# EAGLE design ada2 (EAGLE 6.5.0)
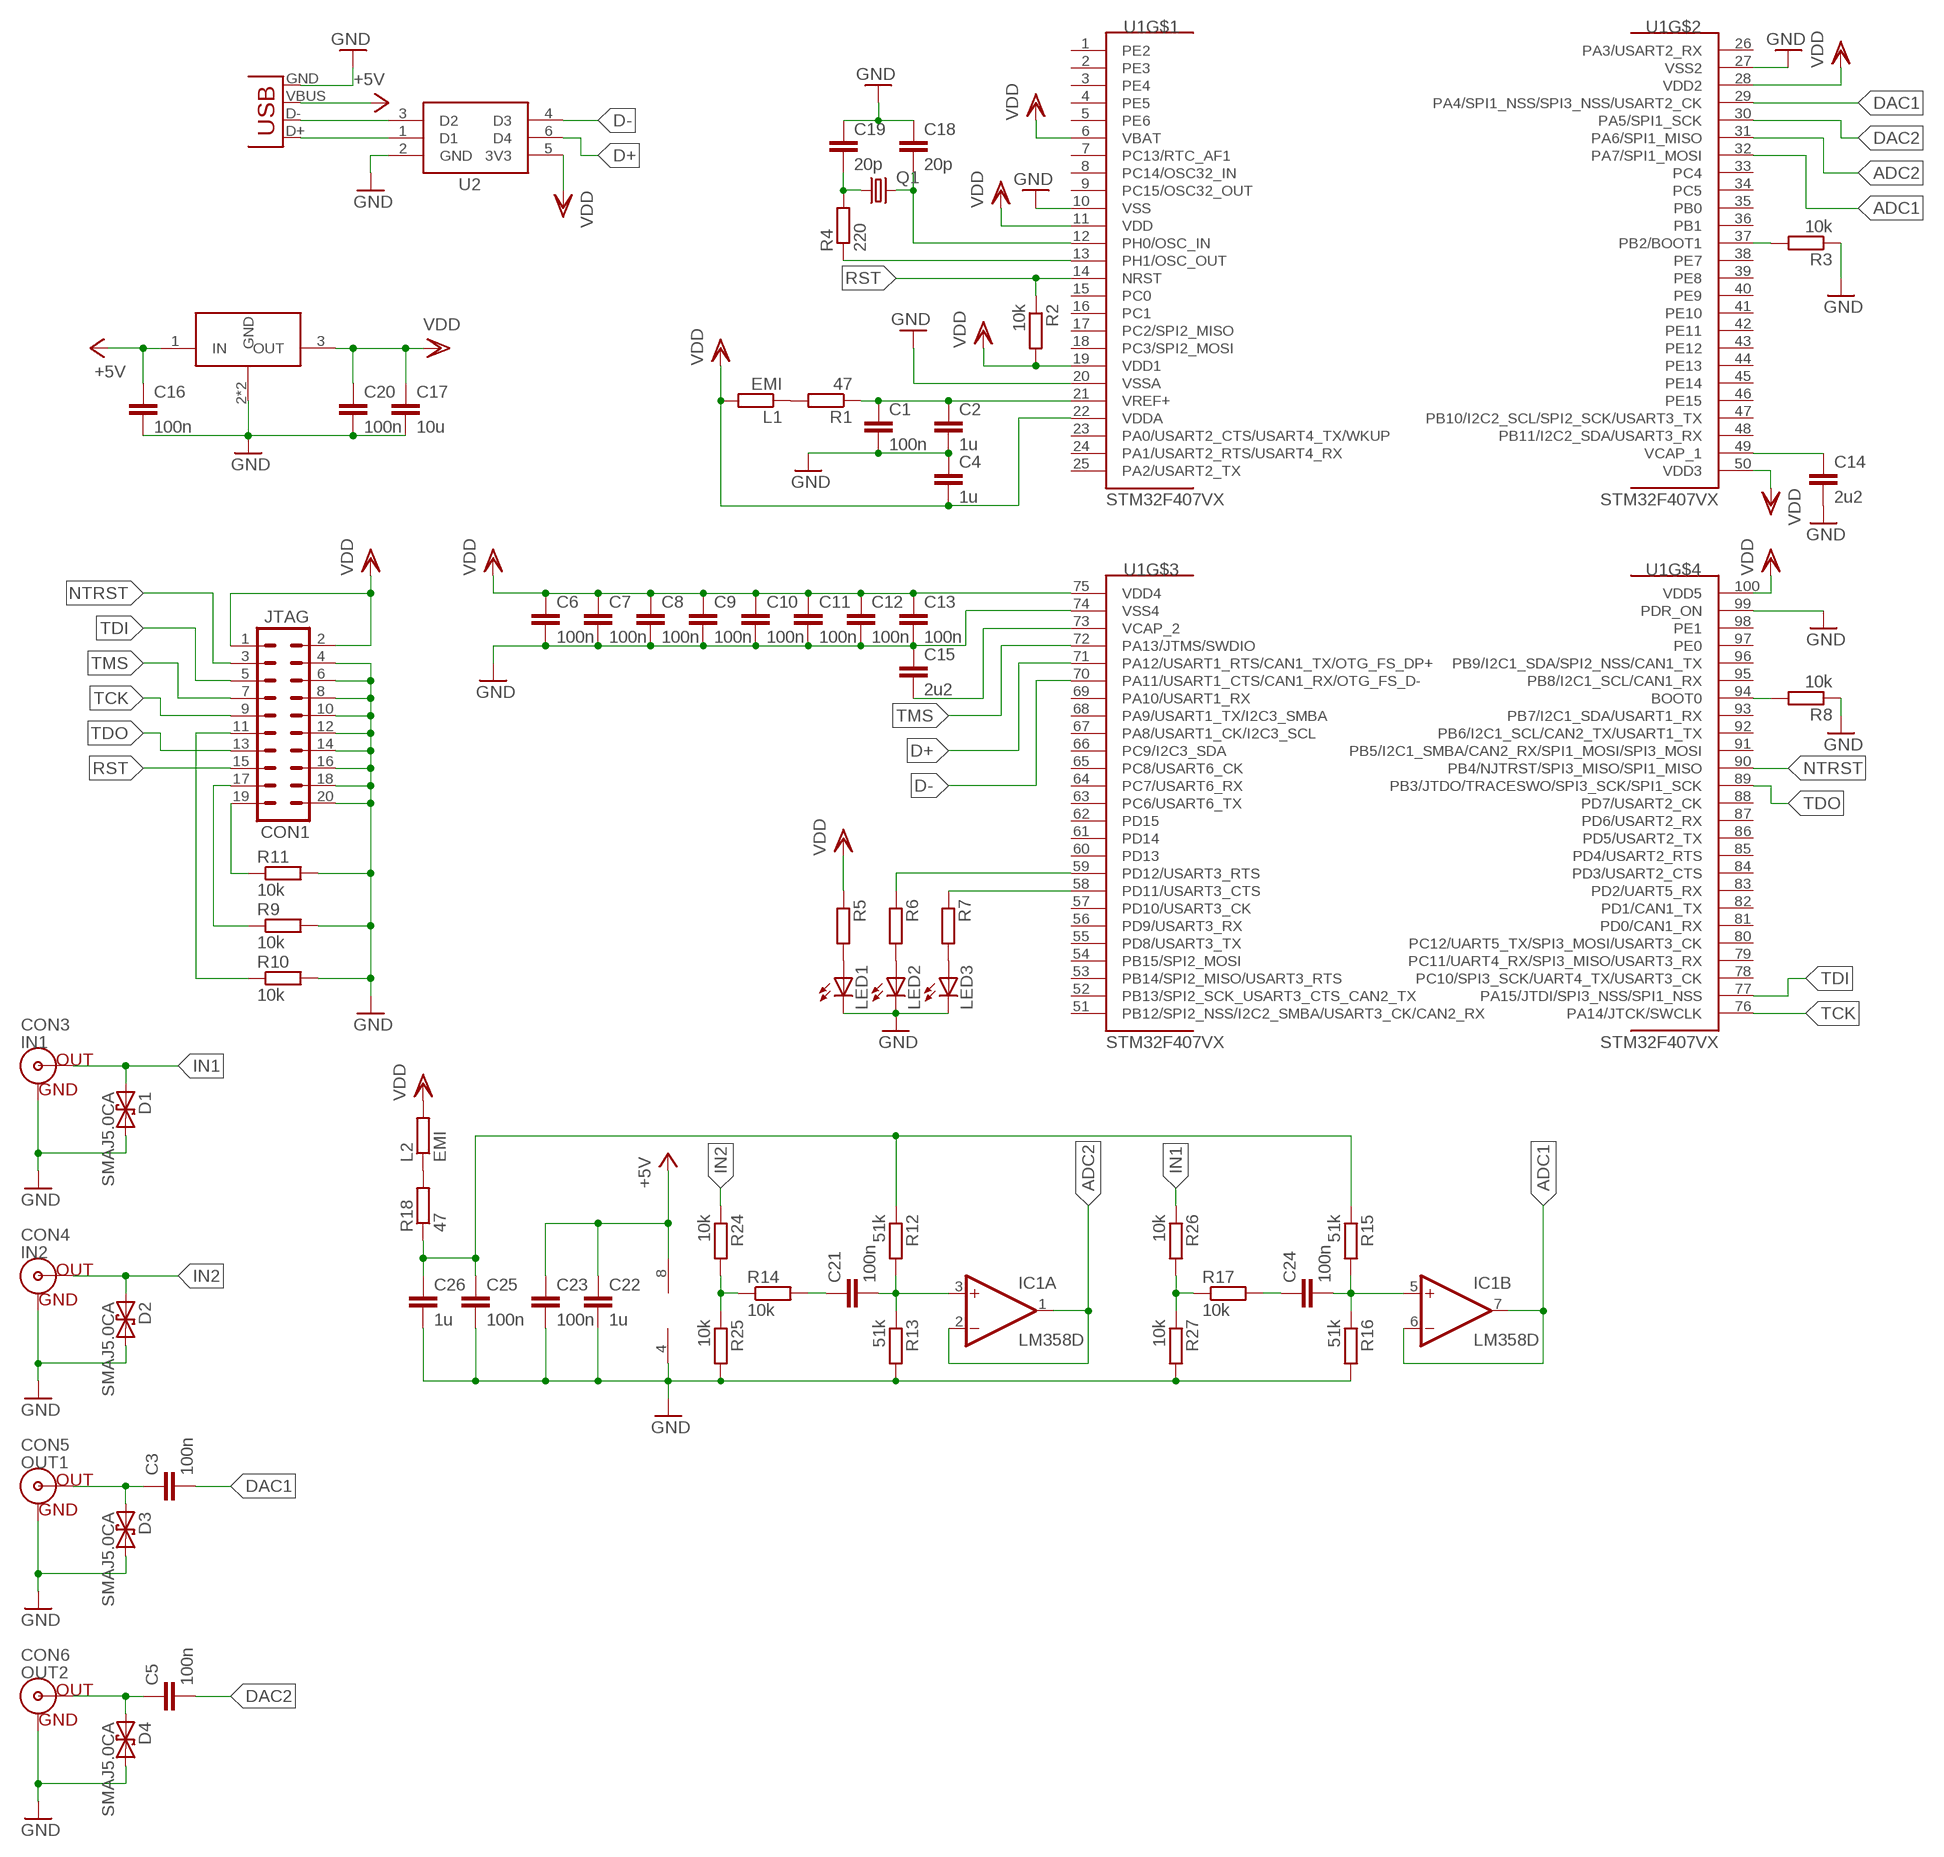
[diagram p0: schematic, sheet 1]

## Parts
C1  100n  C-EUC0603K  [C0603K]
C2  1u  C-EUC0603K  [C0603K]
C3  100n  C-EUC0603K  [C0603K]
C4  1u  C-EUC0603K  [C0603K]
C5  100n  C-EUC0603K  [C0603K]
C6  100n  C-EUC0603K  [C0603K]
C7  100n  C-EUC0603K  [C0603K]
C8  100n  C-EUC0603K  [C0603K]
C9  100n  C-EUC0603K  [C0603K]
C10  100n  C-EUC0603K  [C0603K]
C11  100n  C-EUC0603K  [C0603K]
C12  100n  C-EUC0603K  [C0603K]
C13  100n  C-EUC0603K  [C0603K]
C14  2u2  C-EUC0603K  [C0603K]
C15  2u2  C-EUC0603K  [C0603K]
C16  100n  C-EUC0603K  [C0603K]
C17  10u  C-EUC0603K  [C0603K]
C18  20p  C-EUC0603K  [C0603K]
C19  20p  C-EUC0603K  [C0603K]
C20  100n  C-EUC0603K  [C0603K]
C21  100n  C-EUC0603K  [C0603K]
C22  1u  C-EUC0603K  [C0603K]
C23  100n  C-EUC0603K  [C0603K]
C24  100n  C-EUC0603K  [C0603K]
C25  100n  C-EUC0603K  [C0603K]
C26  1u  C-EUC0603K  [C0603K]
CON1  JTAG  ML20  [ML20]
CON2  USB-B  USBPTH  [USB-B-PTH]
CON3  IN1  BNCPTH  [BNC]
CON4  IN2  BNCPTH  [BNC]
CON5  OUT1  BNCPTH  [BNC]
CON6  OUT2  BNCPTH  [BNC]
D1  SMAJ5.0CA  TVS  [SMA-DIODE]
D2  SMAJ5.0CA  TVS  [SMA-DIODE]
D3  SMAJ5.0CA  TVS  [SMA-DIODE]
D4  SMAJ5.0CA  TVS  [SMA-DIODE]
IC1  LM358D  [SO08]
L1  EMI  R-EU_R0603  [R0603]
L2  EMI  R-EU_R0603  [R0603]
LED1  KONTROLKA_LED  [KONTROLKA_LED]
LED2  KONTROLKA_LED  [KONTROLKA_LED]
LED3  KONTROLKA_LED  [KONTROLKA_LED]
Q1  CRYSTALHC49UP  [HC49UP]
R1  47  R-EU_R0603  [R0603]
R2  10k  R-EU_R0603  [R0603]
R3  10k  R-EU_R0603  [R0603]
R4  220  R-EU_R0603  [R0603]
R5  R-EU_R0603  [R0603]
R6  R-EU_R0603  [R0603]
R7  R-EU_R0603  [R0603]
R8  10k  R-EU_R0603  [R0603]
R9  10k  R-EU_R0603  [R0603]
R10  10k  R-EU_R0603  [R0603]
R11  10k  R-EU_R0603  [R0603]
R12  51k  R-EU_R0603  [R0603]
R13  51k  R-EU_R0603  [R0603]
R14  10k  R-EU_R0603  [R0603]
R15  51k  R-EU_R0603  [R0603]
R16  51k  R-EU_R0603  [R0603]
R17  10k  R-EU_R0603  [R0603]
R18  47  R-EU_R0603  [R0603]
R24  10k  R-EU_R0603  [R0603]
R25  10k  R-EU_R0603  [R0603]
R26  10k  R-EU_R0603  [R0603]
R27  10k  R-EU_R0603  [R0603]
U1  STM32F407VX  [LQFP100]
U2  USBUF01W6  [SOT363]
U3  MCP1703  [SOT223]

## Nets
+5V: C16.1 C22.1 C23.1 CON2.VBUS IC1.8(P:V+) U3.1(IN)
ADC1: IC1.6(B:-IN) IC1.7(B:OUT) U1.32(PA7/SPI1_MOSI)
ADC2: IC1.1(A:OUT) IC1.2(A:-IN) U1.31(PA6/SPI1_MISO)
D+: U1.71(PA12/USART1_RTS/CAN1_TX/OTG_FS_DP+) U2.6(D4)
D-: U1.70(PA11/USART1_CTS/CAN1_RX/OTG_FS_D-) U2.4(D3)
DAC1: C3.2 U1.29(PA4/SPI1_NSS/SPI3_NSS/USART2_CK)
DAC2: C5.2 U1.30(PA5/SPI1_SCK)
GND: C1.2 C2.2 C4.1 C6.2 C7.2 C8.2 C9.2 C10.2 C11.2 C12.2 C13.2 C14.2 C15.1 C16.2 C17.2 C18.1 C19.1 C20.2 C22.2 C23.2 C25.2 C26.2 CON1.4 CON1.6 CON1.8 CON1.10 CON1.12 CON1.14 CON1.16 CON1.18 CON1.20 CON2.GND CON3.GND CON4.GND CON5.GND CON6.GND D1.C D2.C D3.C D4.C IC1.4(P:V-) LED1.K(C) LED2.K(C) LED3.K(C) R3.1 R8.1 R9.2 R10.2 R11.2 R13.2 R16.2 R25.2 R27.2 U1.10(VSS) U1.20(VSSA) U1.27(VSS2) U1.74(VSS4) U1.99(PDR_ON) U2.2(GND) U3.2(GND) U3.2@2(GND)
IN1: CON3.S(OUT) D1.A R26.1
IN2: CON4.S(OUT) D2.A R24.1
N$1: L1.1 R1.2
N$2: C21.1 R14.2
N$3: CON2.D- U2.3(D2)
N$4: CON2.D+ U2.1(D1)
N$5: R4.1 U1.13(PH1/OSC_OUT)
N$6: C19.2 Q1.1 R4.2
N$7: C15.2 U1.73(VCAP_2)
N$8: C14.1 U1.49(VCAP_1)
N$9: C3.1 CON5.S(OUT) D3.A
N$10: R3.2 U1.37(PB2/BOOT1)
N$11: C18.2 Q1.2 U1.12(PH0/OSC_IN)
N$12: LED1.A R5.2
N$13: LED2.A R6.2
N$14: LED3.A R7.2
N$15: R7.1 U1.58(PD11/USART3_CTS)
N$16: R6.1 U1.59(PD12/USART3_RTS)
N$17: C5.1 CON6.S(OUT) D4.A
N$18: CON1.19 R11.1
N$19: CON1.17 R9.1
N$20: CON1.11 R10.1
N$21: R14.1 R24.2 R25.1
N$22: L2.1 R18.2
N$23: C21.2 IC1.3(A:+IN) R12.2 R13.1
N$24: C24.1 R17.2
N$25: C25.1 C26.1 R12.1 R15.1 R18.1
N$26: R17.1 R26.2 R27.1
N$28: R8.2 U1.94(BOOT0)
N$31: C24.2 IC1.5(B:+IN) R15.2 R16.1
NTRST: CON1.3 U1.90(PB4/NJTRST/SPI3_MISO/SPI1_MISO)
RST: CON1.15 R2.1 U1.14(NRST)
TCK: CON1.9 U1.76(PA14/JTCK/SWCLK)
TDI: CON1.5 U1.77(PA15/JTDI/SPI3_NSS/SPI1_NSS)
TDO: CON1.13 U1.89(PB3/JTDO/TRACESWO/SPI3_SCK/SPI1_SCK)
TMS: CON1.7 U1.72(PA13/JTMS/SWDIO)
VDD: C4.2 C6.1 C7.1 C8.1 C9.1 C10.1 C11.1 C12.1 C13.1 C17.1 C20.1 CON1.1 CON1.2 L1.2 L2.2 R2.2 R5.1 U1.6(VBAT) U1.11(VDD) U1.19(VDD1) U1.22(VDDA) U1.28(VDD2) U1.50(VDD3) U1.75(VDD4) U1.100(VDD5) U2.5(3V3) U3.3(OUT)
VREF: C1.1 C2.1 R1.1 U1.21(VREF+)
Unconnected: U1.1(PE2) U1.2(PE3) U1.3(PE4) U1.4(PE5) U1.5(PE6) U1.7(PC13/RTC_AF1) U1.8(PC14/OSC32_IN) U1.9(PC15/OSC32_OUT) U1.15(PC0) U1.16(PC1) U1.17(PC2/SPI2_MISO) U1.18(PC3/SPI2_MOSI) U1.23(PA0/USART2_CTS/USART4_TX/WKUP) U1.24(PA1/USART2_RTS/USART4_RX) U1.25(PA2/USART2_TX) U1.26(PA3/USART2_RX) U1.33(PC4) U1.34(PC5) U1.35(PB0) U1.36(PB1) U1.38(PE7) U1.39(PE8) U1.40(PE9) U1.41(PE10) U1.42(PE11) U1.43(PE12) U1.44(PE13) U1.45(PE14) U1.46(PE15) U1.47(PB10/I2C2_SCL/SPI2_SCK/USART3_TX) U1.48(PB11/I2C2_SDA/USART3_RX) U1.51(PB12/SPI2_NSS/I2C2_SMBA/USART3_CK/CAN2_RX) U1.52(PB13/SPI2_SCK_USART3_CTS_CAN2_TX) U1.53(PB14/SPI2_MISO/USART3_RTS) U1.54(PB15/SPI2_MOSI) U1.55(PD8/USART3_TX) U1.56(PD9/USART3_RX) U1.57(PD10/USART3_CK) U1.60(PD13) U1.61(PD14) U1.62(PD15) U1.63(PC6/USART6_TX) U1.64(PC7/USART6_RX) U1.65(PC8/USART6_CK) U1.66(PC9/I2C3_SDA) U1.67(PA8/USART1_CK/I2C3_SCL) U1.68(PA9/USART1_TX/I2C3_SMBA) U1.69(PA10/USART1_RX) U1.78(PC10/SPI3_SCK/UART4_TX/USART3_CK) U1.79(PC11/UART4_RX/SPI3_MISO/USART3_RX) U1.80(PC12/UART5_TX/SPI3_MOSI/USART3_CK) U1.81(PD0/CAN1_RX) U1.82(PD1/CAN1_TX) U1.83(PD2/UART5_RX) U1.84(PD3/USART2_CTS) U1.85(PD4/USART2_RTS) U1.86(PD5/USART2_TX) U1.87(PD6/USART2_RX) U1.88(PD7/USART2_CK) U1.91(PB5/I2C1_SMBA/CAN2_RX/SPI1_MOSI/SPI3_MOSI) U1.92(PB6/I2C1_SCL/CAN2_TX/USART1_TX) U1.93(PB7/I2C1_SDA/USART1_RX) U1.95(PB8/I2C1_SCL/CAN1_RX) U1.96(PB9/I2C1_SDA/SPI2_NSS/CAN1_TX) U1.97(PE0) U1.98(PE1)

## Library data of the parts
C1-C26 = rcl:C-EU: CAPACITOR, European symbol
CON1 = con-ml:ML20: HARTING
CON2 = SparkFun-Connectors:USB: USB Connectors USB-B-PTH is fully proven SKU : PRT-00139/CONN-08278 USB-miniB is fully proven SKU : PRT-00587 USB-A-PCB is untested. USB-A-H is throughly reviewed, but untested. Spark Fun Electronics SKU : PRT-00437 USB-B-SMT is throughly reviewed, but untested. Needs silkscreen touching up. USB-A-S has not been used/tested USB-MB-H has not been used/tested USB-MICROB has been used. CONN-09505; PROD_ID: CONN-08278
CON3-CON6 = SparkFun:BNC: BNC Connector, Mouser Part# 5227161
D1-D4 = SparkFun:TVS
IC1 = linear:LM358: OP AMP also LM158; LM258; LM2904 Source: http://cache.national.com/ds/LM/LM158.pdf
L1 L2 R1-R18 R24-R27 = rcl:R-EU_: RESISTOR, European symbol
LED1-LED3 = Gibol2:KONTROLKA_LED
Q1 = crystal:CRYSTAL: CRYSTAL; OC_FARNELL: unknown; OC_NEWARK: unknown
U1 = STM32F407Vx_LQFP100:STM32F407VX: STmicroelectronics Cortex M4 Series Typ: STM32F407Vx LQFP100 Copyright 2012 by Ersan Günes, Quantitec, info@quantitec.de
U2 = Gibol2:USBUF01W6
U3 = Gibol:MCP1703

## Board
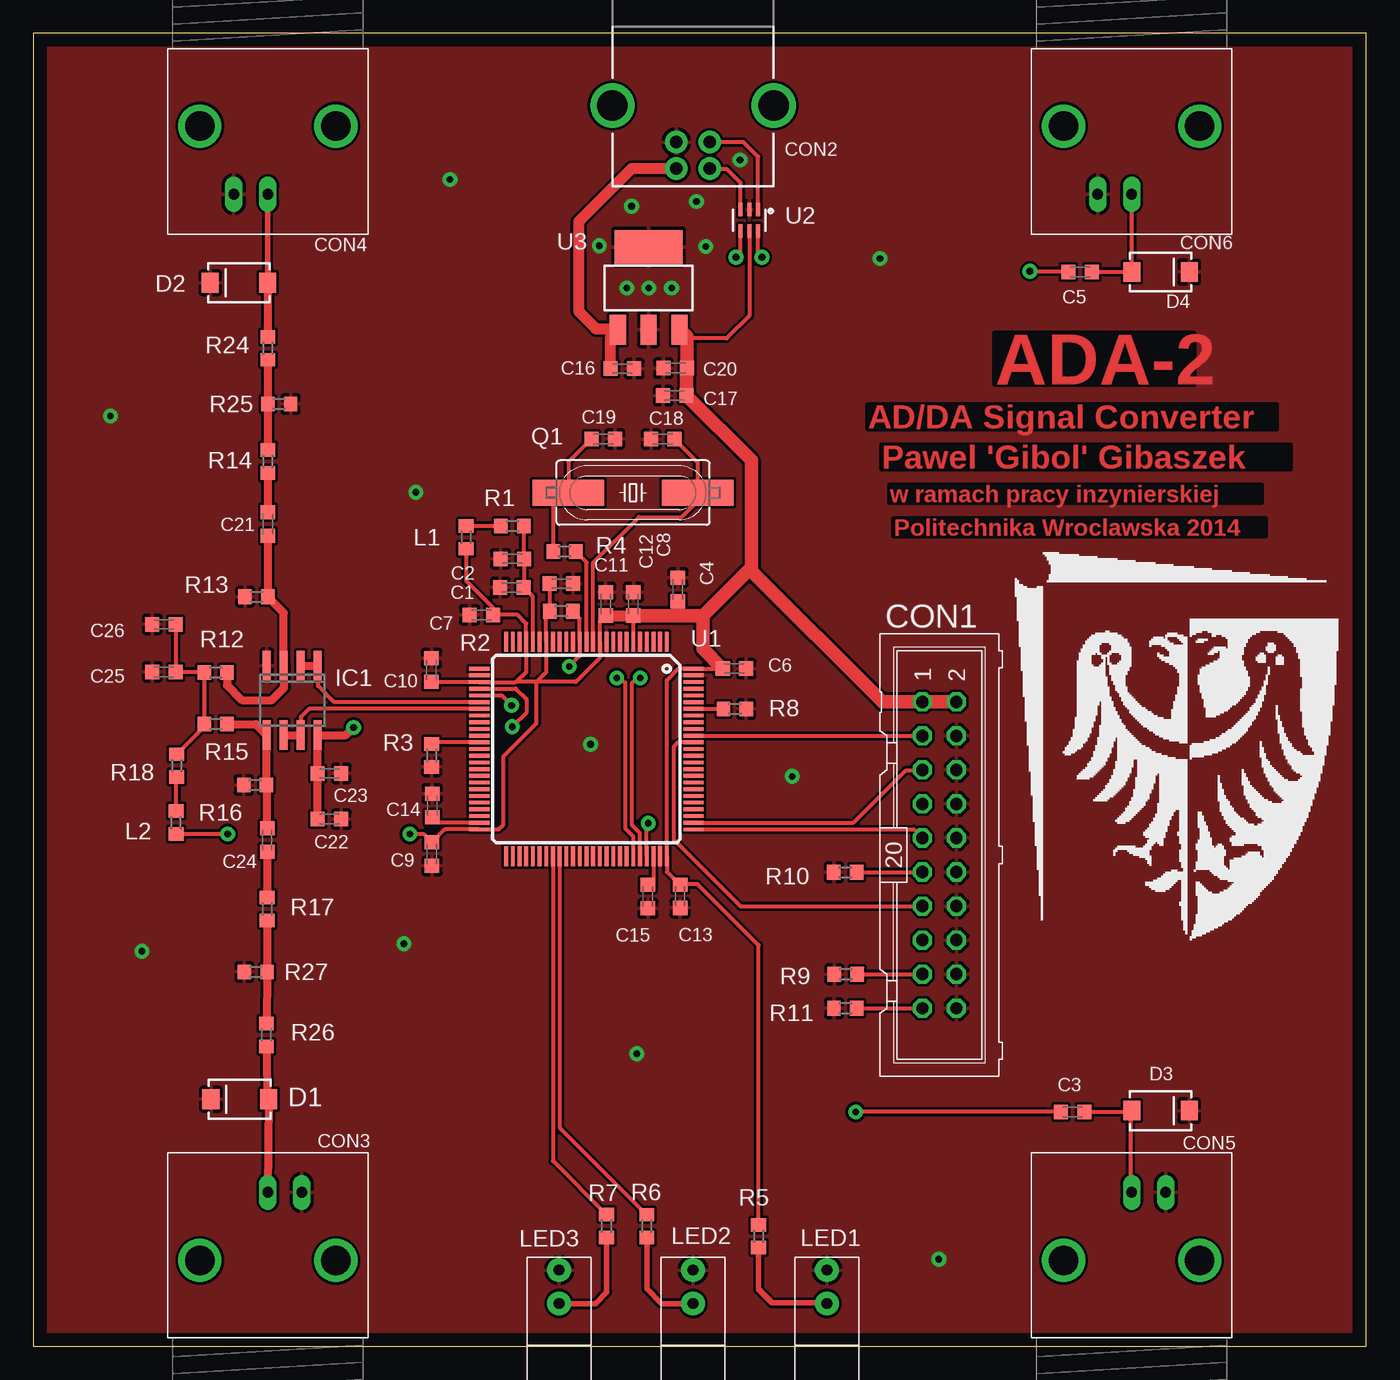
[diagram p1: board, top side]
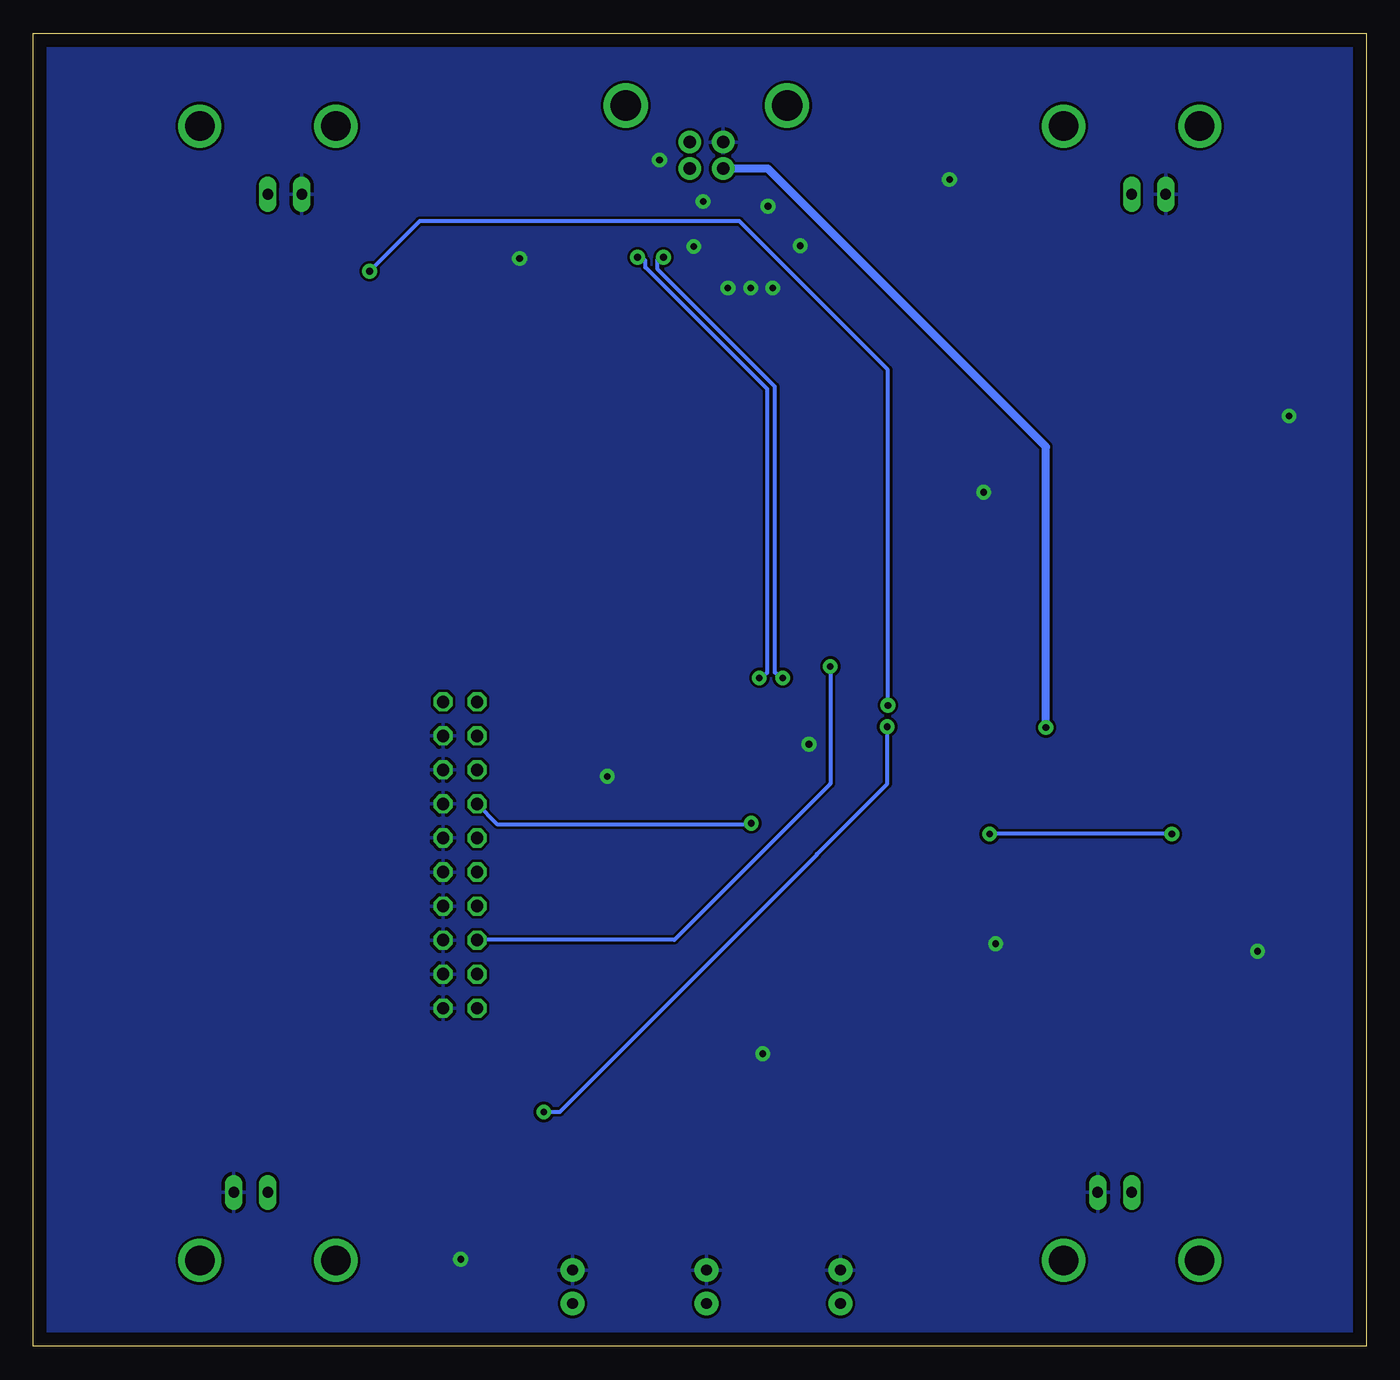
[diagram p2: board, bottom side, seen from below]

Size 99.5 x 98 mm. Coordinates in mm from the lower left corner, seen from the top.
Outline: 0,0 99.5,0 99.5,98 0,98 0,0
Copper layers (1*16): Top 0.035mm / dielectric 1.5mm / Bottom 0.035mm
Design rules "default *": minimum track width 8mil, minimum drill 0.5mm, track to track 8mil, track to pad 8mil, pad to pad 8mil, via to via 8mil, smd to smd 8mil, copper to edge 40mil, drill to drill 8mil, minimum pad ring 10mil, minimum via ring 8mil, stop-mask expansion 4mil, vias tented up to drill 0mil, thermal gap 10mil

### Footprints (pad centres in the part's own frame; a part is rotated, then mirrored left to right if it is on the bottom)
C0603K = smd 1.05 x 1.08: 1 -0.875,0; 2 0.875,0
ML20 = drill 0.914 octagon: 1 -11.43,-1.27; 2 -11.43,1.27; 3 -8.89,-1.27; 4 -8.89,1.27; 5 -6.35,-1.27; 6 -6.35,1.27; 7 -3.81,-1.27; 8 -3.81,1.27; 9 -1.27,-1.27; 10 -1.27,1.27; 11 1.27,-1.27; 12 1.27,1.27; 13 3.81,-1.27; 14 3.81,1.27; 15 6.35,-1.27; 16 6.35,1.27; 17 8.89,-1.27; 18 8.89,1.27; 19 11.43,-1.27; 20 11.43,1.27
USB-B-PTH = drill 0.914 pad 1.676: D+ 0,1.25; D- 1.981,1.25; GND 0,-1.25; VBUS 1.981,-1.25 | drill 2.286: S1 -2.718,-6.02; S2 -2.718,6.02
BNC = drill 2.2: 3 -5.08,5.08; 4 5.08,5.08 | drill 0.8 long: GND -2.54,0; S 0,0
SMA-DIODE = smd 1.27 x 1.47: A -2.15,0; C 2.15,0
SO08 = smd 0.6 x 2.2: 1 -1.905,-2.6; 2 -0.635,-2.6; 3 0.635,-2.6; 4 1.905,-2.6; 5 1.905,2.6; 6 0.635,2.6; 7 -0.635,2.6; 8 -1.905,2.6
R0603 = smd 1 x 1.1: 1 -0.85,0; 2 0.85,0
KONTROLKA_LED = drill 0.8 pad 1.778: A 0,-1.25; K 0,1.25
HC49UP = smd 5.334 x 1.93: 1 -4.826,0; 2 4.826,0
LQFP100 = smd 1.5 x 0.28: 1 -8,6; 2 -8,5.5; 3 -8,5; 4 -8,4.5; 5 -8,4; 6 -8,3.5; 7 -8,3; 8 -8,2.5; 9 -8,2; 10 -8,1.5; 11 -8,1; 12 -8,0.5; 13 -8,0; 14 -8,-0.5; 15 -8,-1; 16 -8,-1.5; 17 -8,-2; 18 -8,-2.5; 19 -8,-3; 20 -8,-3.5; 21 -8,-4; 22 -8,-4.5; 23 -8,-5; 24 -8,-5.5; 25 -8,-6; 51 8,-6; 52 8,-5.5; 53 8,-5; 54 8,-4.5; 55 8,-4; 56 8,-3.5; 57 8,-3; 58 8,-2.5; 59 8,-2; 60 8,-1.5; 61 8,-1; 62 8,-0.5; 63 8,0; 64 8,0.5; 65 8,1; 66 8,1.5; 67 8,2; 68 8,2.5; 69 8,3; 70 8,3.5; 71 8,4; 72 8,4.5; 73 8,5; 74 8,5.5; 75 8,6 | smd 0.28 x 1.5: 26 -6,-8; 27 -5.5,-8; 28 -5,-8; 29 -4.5,-8; 30 -4,-8; 31 -3.5,-8; 32 -3,-8; 33 -2.5,-8; 34 -2,-8; 35 -1.5,-8; 36 -1,-8; 37 -0.5,-8; 38 0,-8; 39 0.5,-8; 40 1,-8; 41 1.5,-8; 42 2,-8; 43 2.5,-8; 44 3,-8; 45 3.5,-8; 46 4,-8; 47 4.5,-8; 48 5,-8; 49 5.5,-8; 50 6,-8; 76 6,8; 77 5.5,8; 78 5,8; 79 4.5,8; 80 4,8; 81 3.5,8; 82 3,8; 83 2.5,8; 84 2,8; 85 1.5,8; 86 1,8; 87 0.5,8; 88 0,8; 89 -0.5,8; 90 -1,8; 91 -1.5,8; 92 -2,8; 93 -2.5,8; 94 -3,8; 95 -3.5,8; 96 -4,8; 97 -4.5,8; 98 -5,8; 99 -5.5,8; 100 -6,8
SOT363 = smd 0.3 x 0.99: 1 -0.65,-0.8; 2 0,-0.8; 3 0.65,-0.8; 4 0.65,0.81; 5 0,0.81; 6 -0.65,0.81
SOT223 = smd 1.219 x 2.235: 1 -2.311,-3.099; 2 0,-3.099; 3 2.311,-3.099 | smd 5.08 x 2.54: 2@2 0,3.048

### Placement (x,y rotation side)
C1  35.72,56.65 180 top
C2  35.75,58.79 180 top
C3  77.6,17.5 180 top
C4  48.11,56.51 270 top
C5  78.15,80.2 180 top
C6  52.34,50.6 0 top
C7  33.44,54.6 180 top
C8  44.8,55.43 90 top
C9  29.75,36.75 270 top
C10  29.72,50.49 90 top
C11  39.41,56.93 0 top
C12  42.72,55.43 90 top
C13  48.28,33.6 270 top
C14  29.77,40.38 90 top
C15  45.87,33.57 90 top
C16  43.97,72.98 0 top
C17  47.89,70.97 180 top
C18  47,67.73 0 top
C19  42.54,67.74 180 top
C20  47.91,73.02 180 top
C21  17.5,61.4 270 top
C22  22.1,39.36 0 top
C23  22.1,42.78 0 top
C24  17.45,37.8 90 top
C25  9.75,50.35 180 top
C26  9.75,53.9 180 top
CON1  67.65,36.68 270 top
CON2  49.25,89.9 270 top
CON3  17.5,11.5 180 top
CON4  17.5,86 0 top
CON5  82,11.5 180 top
CON6  82,86 0 top
D1  15.4,18.45 180 top
D2  15.35,79.4 180 top
D3  84.15,17.6 0 top
D4  84.15,80.2 0 top
IC1  19.33,48.22 180 top
L1  32.31,60.39 270 top
L2  10.65,39.1 270 top
LED1  59.25,4.45 0 top
LED2  49.25,4.45 0 top
LED3  39.25,4.45 0 top
Q1  44.77,63.73 0 top
R1  35.76,61.23 180 top
R2  39.41,54.88 180 top
R3  29.73,44.11 90 top
R4  39.65,59.34 180 top
R5  54.14,8.22 270 top
R6  45.79,8.98 270 top
R7  42.79,8.99 270 top
R8  52.37,47.58 180 top
R9  60.65,27.78 180 top
R10  60.61,35.39 180 top
R11  60.62,25.24 180 top
R12  13.6,50.3 0 top
R13  16.65,55.95 180 top
R14  17.5,66.05 270 top
R15  13.6,46.45 0 top
R16  16.55,41.9 180 top
R17  17.45,32.65 90 top
R18  10.7,43.35 270 top
R24  17.5,74.5 270 top
R25  18.35,70.35 0 top
R26  17.4,23.25 90 top
R27  16.6,27.95 180 top
U1  41.29,44.59 270 top
U2  53.45,84.06 180 top
U3  45.93,79 0 top

### Tracks (layer width: path | path; a pad name or v marks a point on that pad's centre or on a via)
+5V  (via drill 0.5 pad 1.1)
  Top 0.61: C22.1 C23.1 21.22,45.61 IC1.8 23.32,45.62 v23.9,46.2
  Top 0.813: CON2.VBUS 44.67,87.92 40.7,83.95 40.7,77.25 42,75.95 43.57,75.95 U3.1 43.09,75.38 C16.1
  Bottom 0.61: v23.9,46.2 23.9,67.15 44.67,87.92 CON2.VBUS
ADC1
  Top 0.28: 19.95,45.63 19.95,46.95 20.45,47.45 20.59,47.59 U1.32
  Top 0.305: 19.95,45.63 IC1.7
  Top 0.61: IC1.6 IC1.7
ADC2
  Top 0.28: 21.25,49.3 22.46,48.09 U1.31
  Top 0.305: 21.25,49.3 21.25,50.8 IC1.1
  Top 0.61: IC1.2 IC1.1
D+  (via drill 0.5 pad 1.1)
  Top 0.28: U1.71 45.29,38.31 44.7,38.9 44.7,49.55
  Top 0.305: 44.7,49.55 v45.3,49.9 | v54.4,81.3 54.1,81.5 U2.6
  Bottom 0.305: v45.3,49.9 44.7,50.3 44.7,71.45 53.8,80.55 53.8,81.05 54.05,81.3 v54.4,81.3
D-  (via drill 0.5 pad 1.1)
  Top 0.28: U1.70 44.79,38.06 44.2,38.65 44.2,49.55 v43.55,49.9
  Top 0.305: v52.45,81.3 52.8,81.5 U2.4
  Bottom 0.305: v43.55,49.9 44.15,50.3 44.15,71.65 52.9,80.4 52.9,81.15 v52.45,81.3
DAC1  (via drill 0.5 pad 1.1)
  Top 0.28: U1.29 36.01,49.09 36.8,48.3
  Top 0.305: 36.8,48.3 36.8,47.3 v35.75,46.25 | C3.2 v61.4,17.5
  Bottom 0.305: v35.75,46.25 35.75,42 41,36.75 41,36.7 60.2,17.5 v61.4,17.5
DAC2  (via drill 0.5 pad 1.1)
  Top 0.28: U1.30 34.96,48.59 v35.7,47.85
  Top 0.305: v74.4,80.25 77.23,80.25 C5.2
  Bottom 0.305: v35.7,47.85 35.7,72.9 46.8,84 70.65,84 v74.4,80.25
GND  (via drill 0.5 pad 1.1)
  other vias: 52.75,88.55 8.1,29.5 27.65,30.05 45.05,21.85 41.6,44.95 56.65,42.55 67.6,6.5 5.75,69.45 28.55,63.75 31.1,87.1 63.2,81.2 44.65,85.1 49.5,85.45 50.2,82.1 42.25,82.15 44.3,79 45.95,79 47.65,79
  pour Top: 0,0 99.5,0 99.5,98 0,98
  pour Bottom: 0,98 99.5,98 99.5,0 0,0
IN1
  Top 0.61: R26.1 17.45,17.9 D1.A CON3.S
IN2
  Top 0.406: 17.52,80.37 D2.A CON4.S
  Top 0.61: D2.A R24.1
N$1
  Top 0.305: L1.1 R1.2
N$2
  Top 0.61: R14.2 C21.1
N$3
  Top 0.305: U2.3 52.8,86.85 51.8,87.85 50.57,87.85 CON2.D-
N$4
  Top 0.305: U2.1 54.1,88.8 53,89.9 CON2.D+
N$5
  Top 0.28: U1.13 41.3,58.5 41.24,58.6 R4.1
N$6
  Top 0.305: R4.2 38.85,59.39 38.85,63.55 39.03,63.73 Q1.1 39.94,66.02 C19.2
N$7
  Top 0.305: U1.73 46.29,34.09 C15.2
N$8
  Top 0.28: U1.49 30.18,39.09
  Top 0.305: 30.18,39.09 C14.1
N$9
  Top 0.305: C3.1 81.9,17.5 | 81.9,17.5 D3.A | 81.9,17.5 81.9,11.6 CON5.S
N$10
  Top 0.305: U1.37 29.86,45.09 R3.2
N$11
  Top 0.28: U1.12 41.79,58.49 45.2,61.9
  Top 0.305: 45.2,61.9 48.4,61.9 50.1,63.6 51.87,63.6 Q1.2 49.6,66.01 C18.2
N$12
  Top 0.406: R5.2 54.14,4.26 55.15,3.25 59.2,3.25 LED1.A
N$13
  Top 0.406: LED2.A 46.9,3.2 45.8,4.3 R6.2
N$14
  Top 0.406: LED3.A 41.95,3.2 42.8,4.05 R7.2
N$15
  Top 0.28: U1.58 38.79,13.84
  Top 0.305: 38.79,13.84 R7.1
N$16
  Top 0.28: U1.59 39.29,16.33
  Top 0.305: 39.29,16.33 R6.1
N$17
  Top 0.305: C5.1 D4.A CON6.S
N$18
  Top 0.305: R11.1 CON1.19
N$19
  Top 0.305: R9.1 CON1.17
N$20
  Top 0.305: R10.1 66.36,35.39 CON1.11
N$21
  Top 0.61: R24.2 R25.1 R14.1
N$22
  Top 0.305: L2.1 10.65,42.45 R18.2
N$23
  Top 0.61: R12.2 14.45,49.35 15.55,48.25 17.8,48.25 18.7,49.15 IC1.3 18.7,54.76 R13.1 C21.2
N$24
  Top 0.61: C24.1 R17.2
N$25
  Top 0.305: C26.1 C25.1 12.7,50.35 R12.1 R15.1 12.75,46.25 R18.1
N$26
  Top 0.61: R17.1 R27.1 R26.2
N$28
  Top 0.305: U1.94 51.86,47.59 R8.2
N$31
  Top 0.61: C24.2 17.45,41.85 R16.1 17.4,45.59 IC1.5 16.59,46.45 R15.2
NTRST
  Top 0.28: U1.90 66.36,45.59
  Top 0.305: 66.36,45.59 CON1.3
RST  (via drill 0.5 pad 1.1)
  Top 0.28: U1.14 40.79,54.35
  Top 0.305: 40.79,54.35 R2.1 | U1.14 40.79,51.54 v40,50.75
  Bottom 0.305: v40,50.75 40,42 51.65,30.35 66.36,30.35 CON1.15
TCK
  Top 0.28: U1.76 65.74,38.59
  Top 0.305: 65.74,38.59 CON1.9
TDI
  Top 0.28: U1.77 61.24,39.09 65.15,43
  Top 0.305: 65.15,43 66.35,43 CON1.5
TDO
  Top 0.28: U1.89 48.14,45.09 47.8,44.75
  Top 0.305: 47.8,44.75 47.8,37.85 52.8,32.85 66.36,32.85 CON1.13
TMS  (via drill 0.5 pad 1.1)
  Top 0.28: U1.72 45.79,38.79
  Top 0.305: 45.79,38.79 v45.9,39.05
  Bottom 0.28: v45.9,39.05 46.25,39.05 46.35,38.95 64.84,38.95 CON1.7
VDD  (via drill 0.5 pad 1.1)
  Top 0.28: 29.74,49.59 U1.28 35.99,49.59 | U1.50 30.71,38.59 C9.1 | U1.22 36.79,53.96 | U1.11 42.29,54.12 | U1.6 C8.1 | 37.55,49.6 36.05,49.6 | 36.05,49.6 36,49.6 | 36.79,50.34 36.05,49.6 | C6.1 U1.100 48.14,50.59 47.29,49.74
  Top 0.305: 29.74,49.59 C10.1 | 36.79,53.96 36.15,54.6 C7.1 34.3,54.62 34.3,55.15 32.31,57.14 L1.2 | 42.29,54.12 C12.1 | C8.1 | U1.11 42.29,51.39 40.5,49.6 37.55,49.6 | C11.1 38.56,56.91 R2.2 38.29,54.61 U1.19 | U1.22 36.79,50.34 | U1.19 38.29,51.44 | U1.19 38.29,50.34 37.55,49.6 | 37.55,49.6 37.55,46.5 35.1,44.05 35.1,38.95 34.74,38.59 U1.50 | 35.99,49.59 36,49.6 | 47.29,49.74 U1.75 47.29,35.41 C13.1 48.3,34.5 49.6,34.5 54.14,29.96 R5.1 | U2.5 53.45,76.95 51.75,75.25 48.78,75.25 | L2.2 v14.5,38.25 | v28.1,38.25 29.12,38.25 C9.1
  Top 0.813: C12.1 C8.1
  Top 1.016: U3.3 48.78,75.36 48.78,75.25 C20.1 48.77,73 C17.1 53.6,66.14 53.6,58.15 53.48,58.02 | 53.48,58.02 50,54.55 | 50,54.55 48.07,54.55 | 48.07,54.55 C8.1 | C6.1 50,52.06 50,54.55 | 48.07,54.55 48.11,54.6 C4.2 | CON1.2 CON1.1 63.39,48.11 53.48,58.02
  Bottom 0.305: v14.5,38.25 v28.1,38.25
VREF
  Top 0.28: U1.21 37.29,55.95
  Top 0.305: 37.29,55.95 C1.1 36.62,56.68 C2.1 36.61,58.8 R1.1

### Text on the board
Top: ADA-2 | AD/DA Signal Converter | Pawel 'Gibol' Gibaszek | w ramach pracy inzynierskiej | Politechnika Wroclawska 2014
tNames: U2